# Altium project Cap_Sensor_8x8.PrjPcb
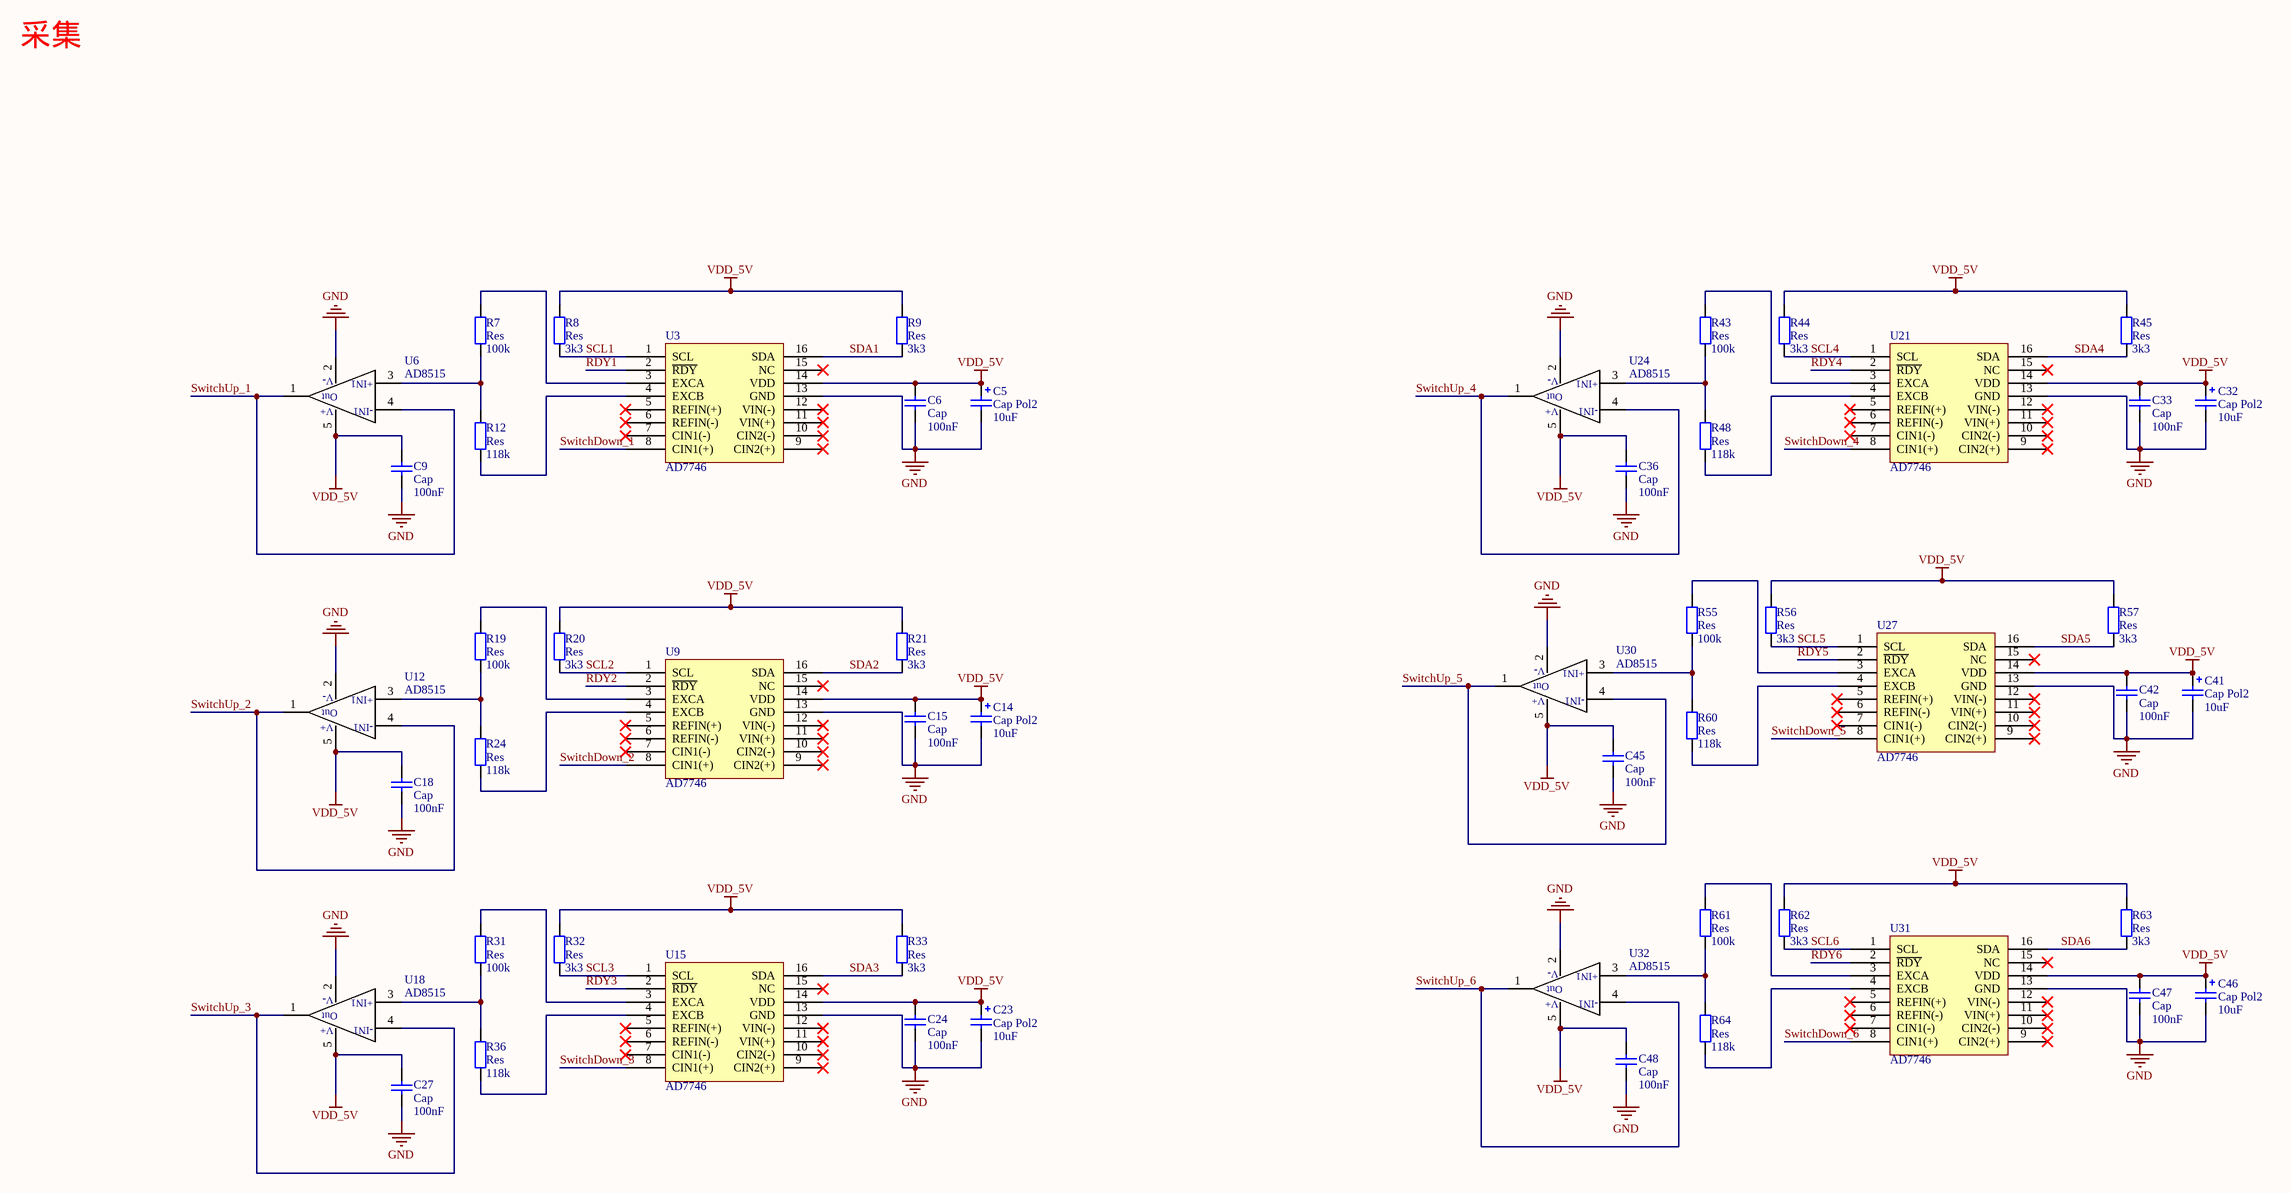
[diagram p0: Cap_Sensor_hand.SchDoc]
2 sheets, 69 parts. Net scope: global (net labels, ports and power ports of the same name join across sheets).
Board file: Cap_Sensor_hand.PcbDoc
Sheets:
  Cap_Sensor_hand.SchDoc
  power_and_interface.SchDoc

## Sheet Cap_Sensor_hand.SchDoc
size A2

### Parts
C5  Cap Pol2  value 10uF  [Cap-TA]
C6  Cap  value 100nF  [0805C]
C9  Cap  value 100nF  [0805C]
C14  Cap Pol2  value 10uF  [Cap-TA]
C15  Cap  value 100nF  [0805C]
C18  Cap  value 100nF  [0805C]
C23  Cap Pol2  value 10uF  [Cap-TA]
C24  Cap  value 100nF  [0805C]
C27  Cap  value 100nF  [0805C]
C32  Cap Pol2  value 10uF  [Cap-TA]
C33  Cap  value 100nF  [0805C]
C36  Cap  value 100nF  [0805C]
C41  Cap Pol2  value 10uF  [Cap-TA]
C42  Cap  value 100nF  [0805C]
C45  Cap  value 100nF  [0805C]
C46  Cap Pol2  value 10uF  [Cap-TA]
C47  Cap  value 100nF  [0805C]
C48  Cap  value 100nF  [0805C]
R7  Res  value 100k  [0805R]
R8  Res  value 3k3  [0805R]
R9  Res  value 3k3  [0805R]
R12  Res  value 118k  [0805R]
R19  Res  value 100k  [0805R]
R20  Res  value 3k3  [0805R]
R21  Res  value 3k3  [0805R]
R24  Res  value 118k  [0805R]
R31  Res  value 100k  [0805R]
R32  Res  value 3k3  [0805R]
R33  Res  value 3k3  [0805R]
R36  Res  value 118k  [0805R]
R43  Res  value 100k  [0805R]
R44  Res  value 3k3  [0805R]
R45  Res  value 3k3  [0805R]
R48  Res  value 118k  [0805R]
R55  Res  value 100k  [0805R]
R56  Res  value 3k3  [0805R]
R57  Res  value 3k3  [0805R]
R60  Res  value 118k  [0805R]
R61  Res  value 100k  [0805R]
R62  Res  value 3k3  [0805R]
R63  Res  value 3k3  [0805R]
R64  Res  value 118k  [0805R]
U3  AD7746  [TSSOP16]
U6  AD8515  [sot23-5]
U9  AD7746  [TSSOP16]
U12  AD8515  [sot23-5]
U15  AD7746  [TSSOP16]
U18  AD8515  [sot23-5]
U21  AD7746  [TSSOP16]
U24  AD8515  [sot23-5]
U27  AD7746  [TSSOP16]
U30  AD8515  [sot23-5]
U31  AD7746  [TSSOP16]
U32  AD8515  [sot23-5]

### Nets
GND: C5.2 C6.1 C9.1 C14.2 C15.1 C18.1 C23.2 C24.1 C27.1 C32.2 C33.1 C36.1 C41.2 C42.1 C45.1 C46.2 C47.1 C48.1 U3.13(GND) U6.2(V-) U9.13(GND) U12.2(V-) U15.13(GND) U18.2(V-) U21.13(GND) U24.2(V-) U27.13(GND) U30.2(V-) U31.13(GND) U32.2(V-)
VDD_5V: C5.1 C6.2 C9.2 C14.1 C15.2 C18.2 C23.1 C24.2 C27.2 C32.1 C33.2 C36.2 C41.1 C42.2 C45.2 C46.1 C47.2 C48.2 R8.2 R9.2 R20.2 R21.2 R32.2 R33.2 R44.2 R45.2 R56.2 R57.2 R62.2 R63.2 U3.14(VDD) U6.5(V+) U9.14(VDD) U12.5(V+) U15.14(VDD) U18.5(V+) U21.14(VDD) U24.5(V+) U27.14(VDD) U30.5(V+) U31.14(VDD) U32.5(V+)
RDY1: U3.2(~{RDY})
RDY2: U9.2(~{RDY})
RDY3: U15.2(~{RDY})
RDY4: U21.2(~{RDY})
RDY5: U27.2(~{RDY})
RDY6: U31.2(~{RDY})
SCL1: R8.1 U3.1(SCL)
SCL2: R20.1 U9.1(SCL)
SCL3: R32.1 U15.1(SCL)
SCL4: R44.1 U21.1(SCL)
SCL5: R56.1 U27.1(SCL)
SCL6: R62.1 U31.1(SCL)
SDA1: R9.1 U3.16(SDA)
SDA2: R21.1 U9.16(SDA)
SDA3: R33.1 U15.16(SDA)
SDA4: R45.1 U21.16(SDA)
SDA5: R57.1 U27.16(SDA)
SDA6: R63.1 U31.16(SDA)
SwitchDown_1: U3.8(CIN1(+))
SwitchDown_2: U9.8(CIN1(+))
SwitchDown_3: U15.8(CIN1(+))
SwitchDown_4: U21.8(CIN1(+))
SwitchDown_5: U27.8(CIN1(+))
SwitchDown_6: U31.8(CIN1(+))
SwitchUp_1: U6.1(Out1) U6.4(-IN)
SwitchUp_2: U12.1(Out1) U12.4(-IN)
SwitchUp_3: U18.1(Out1) U18.4(-IN)
SwitchUp_4: U24.1(Out1) U24.4(-IN)
SwitchUp_5: U30.1(Out1) U30.4(-IN)
SwitchUp_6: U32.1(Out1) U32.4(-IN)
NetR7_1: R7.1 U3.3(EXCA)
NetR7_2: R7.2 R12.1 U6.3(+IN)
NetR12_2: R12.2 U3.4(EXCB)
NetR19_1: R19.1 U9.3(EXCA)
NetR19_2: R19.2 R24.1 U12.3(+IN)
NetR24_2: R24.2 U9.4(EXCB)
NetR31_1: R31.1 U15.3(EXCA)
NetR31_2: R31.2 R36.1 U18.3(+IN)
NetR36_2: R36.2 U15.4(EXCB)
NetR43_1: R43.1 U21.3(EXCA)
NetR43_2: R43.2 R48.1 U24.3(+IN)
NetR48_2: R48.2 U21.4(EXCB)
NetR55_1: R55.1 U27.3(EXCA)
NetR55_2: R55.2 R60.1 U30.3(+IN)
NetR60_2: R60.2 U27.4(EXCB)
NetR61_1: R61.1 U31.3(EXCA)
NetR61_2: R61.2 R64.1 U32.3(+IN)
NetR64_2: R64.2 U31.4(EXCB)

Not connected (* = marked no-connect by the designer): U3 5(REFIN(+))* 6(REFIN(-))* 7(CIN1(-))* 9(CIN2(+))* 10(CIN2(-))* 11(VIN(+))* 12(VIN(-))* 15(NC)*; U9 5(REFIN(+))* 6(REFIN(-))* 7(CIN1(-))* 9(CIN2(+))* 10(CIN2(-))* 11(VIN(+))* 12(VIN(-))* 15(NC)*; U15 5(REFIN(+))* 6(REFIN(-))* 7(CIN1(-))* 9(CIN2(+))* 10(CIN2(-))* 11(VIN(+))* 12(VIN(-))* 15(NC)*; U21 5(REFIN(+))* 6(REFIN(-))* 7(CIN1(-))* 9(CIN2(+))* 10(CIN2(-))* 11(VIN(+))* 12(VIN(-))* 15(NC)*; U27 5(REFIN(+))* 6(REFIN(-))* 7(CIN1(-))* 9(CIN2(+))* 10(CIN2(-))* 11(VIN(+))* 12(VIN(-))* 15(NC)*; U31 5(REFIN(+))* 6(REFIN(-))* 7(CIN1(-))* 9(CIN2(+))* 10(CIN2(-))* 11(VIN(+))* 12(VIN(-))* 15(NC)*

### Notes on the sheet
- Labels drawn without touching a wire or pin: 采集
- Title
- Size:
- Date:
- File:
- A2
- Number:
- Time:
- Revision:
- Sheet
- of
- (in symbol AD8515) +IN1; Out; -IN1

### Library data of the parts
C5 C14 C23 C32 C41 C46 = Cap Pol2: Polarized Capacitor (Axial); Published: 8-Jun-2000; LatestRevisionDate: 17-Jul-2002; LatestRevisionNote: Re-released for DXP Platform.; PackageReference: POLAR0.8; Publisher: Altium Limited; PackageDescription: Polarized Capacitor; 2 Leads
C6 C9 C15 C18 C24 C27 C33 C36 C42 C45 C47 C48 = Cap: Capacitor; Published: 8-Jun-2000; LatestRevisionDate: 17-Jul-2002; LatestRevisionNote: Re-released for DXP Platform.; PackageReference: RAD-0.3; Publisher: Altium Limited; PackageDescription: Radial Cap, Thru-Hole; 2 Leads; 0.3 in Pin Spacing
R7-R9 R12 R19-R21 R24 R31-R33 R36 R43-R45 R48 R55-R57 R60-R64 = Res: Resistor; Published: 8-Jun-2000; LatestRevisionDate: 17-Jul-2002; LatestRevisionNote: Re-released for DXP Platform.; PackageReference: AXIAL-0.4; Publisher: Altium Limited; PackageDescription: Axial Device, Thru-Hole; 2 Leads; 0.4 in Pin Spacing

## Sheet power_and_interface.SchDoc
size A4
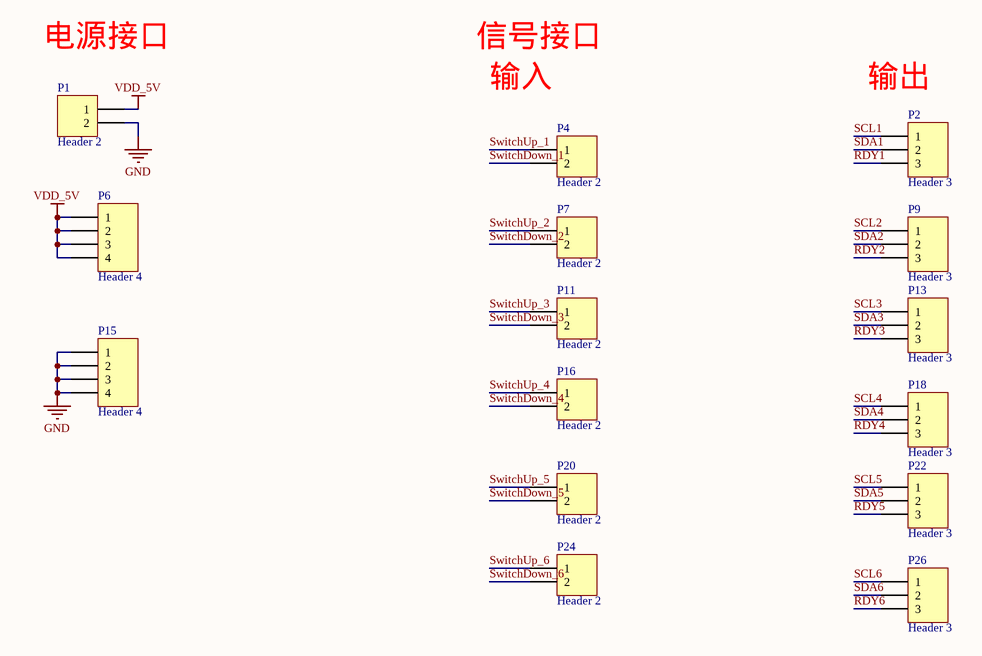
[diagram p1: power_and_interface.SchDoc]

### Parts
P1  Header 2  [XH2.54-LI-2P]
P2  Header 3  [XH2.0_3p]
P4  Header 2  [XH2.0_2p]
P6  Header 4  [HDR1X4]
P7  Header 2  [XH2.0_2p]
P9  Header 3  [XH2.0_3p]
P11  Header 2  [XH2.0_2p]
P13  Header 3  [XH2.0_3p]
P15  Header 4  [HDR1X4]
P16  Header 2  [XH2.0_2p]
P18  Header 3  [XH2.0_3p]
P20  Header 2  [XH2.0_2p]
P22  Header 3  [XH2.0_3p]
P24  Header 2  [XH2.0_2p]
P26  Header 3  [XH2.0_3p]

### Nets
GND: P1.2 P15.1 P15.2 P15.3 P15.4
VDD_5V: P1.1 P6.1 P6.2 P6.3 P6.4
RDY1: P2.3
RDY2: P9.3
RDY3: P13.3
RDY4: P18.3
RDY5: P22.3
RDY6: P26.3
SCL1: P2.1
SCL2: P9.1
SCL3: P13.1
SCL4: P18.1
SCL5: P22.1
SCL6: P26.1
SDA1: P2.2
SDA2: P9.2
SDA3: P13.2
SDA4: P18.2
SDA5: P22.2
SDA6: P26.2
SwitchDown_1: P4.2
SwitchDown_2: P7.2
SwitchDown_3: P11.2
SwitchDown_4: P16.2
SwitchDown_5: P20.2
SwitchDown_6: P24.2
SwitchUp_1: P4.1
SwitchUp_2: P7.1
SwitchUp_3: P11.1
SwitchUp_4: P16.1
SwitchUp_5: P20.1
SwitchUp_6: P24.1

### Notes on the sheet
- Labels drawn without touching a wire or pin: 信号接口, 电源接口, 输入, 输出

### Library data of the parts
P1 P4 P7 P11 P16 P20 P24 = Header 2: Header, 2-Pin; LatestRevisionDate: 17-Jul-2002; LatestRevisionNote: Re-released for DXP Platform.; Publisher: Altium Limited
P2 P9 P13 P18 P22 P26 = Header 3: Header, 3-Pin; LatestRevisionDate: 17-Jul-2002; LatestRevisionNote: Re-released for DXP Platform.; Publisher: Altium Limited
P6 P15 = Header 4: Header, 4-Pin; LatestRevisionDate: 17-Jul-2002; LatestRevisionNote: Re-released for DXP Platform.; Publisher: Altium Limited

## Nets that join several sheets
GND: Cap_Sensor_hand (30 pins), power_and_interface (5 pins)
VDD_5V: Cap_Sensor_hand (42 pins), power_and_interface (5 pins)
RDY1: Cap_Sensor_hand (U3.2), power_and_interface (P2.3)
RDY2: Cap_Sensor_hand (U9.2), power_and_interface (P9.3)
RDY3: Cap_Sensor_hand (U15.2), power_and_interface (P13.3)
RDY4: Cap_Sensor_hand (U21.2), power_and_interface (P18.3)
RDY5: Cap_Sensor_hand (U27.2), power_and_interface (P22.3)
RDY6: Cap_Sensor_hand (U31.2), power_and_interface (P26.3)
SCL1: Cap_Sensor_hand (R8.1 U3.1), power_and_interface (P2.1)
SCL2: Cap_Sensor_hand (R20.1 U9.1), power_and_interface (P9.1)
SCL3: Cap_Sensor_hand (R32.1 U15.1), power_and_interface (P13.1)
SCL4: Cap_Sensor_hand (R44.1 U21.1), power_and_interface (P18.1)
SCL5: Cap_Sensor_hand (R56.1 U27.1), power_and_interface (P22.1)
SCL6: Cap_Sensor_hand (R62.1 U31.1), power_and_interface (P26.1)
SDA1: Cap_Sensor_hand (R9.1 U3.16), power_and_interface (P2.2)
SDA2: Cap_Sensor_hand (R21.1 U9.16), power_and_interface (P9.2)
SDA3: Cap_Sensor_hand (R33.1 U15.16), power_and_interface (P13.2)
SDA4: Cap_Sensor_hand (R45.1 U21.16), power_and_interface (P18.2)
SDA5: Cap_Sensor_hand (R57.1 U27.16), power_and_interface (P22.2)
SDA6: Cap_Sensor_hand (R63.1 U31.16), power_and_interface (P26.2)
SwitchDown_1: Cap_Sensor_hand (U3.8), power_and_interface (P4.2)
SwitchDown_2: Cap_Sensor_hand (U9.8), power_and_interface (P7.2)
SwitchDown_3: Cap_Sensor_hand (U15.8), power_and_interface (P11.2)
SwitchDown_4: Cap_Sensor_hand (U21.8), power_and_interface (P16.2)
SwitchDown_5: Cap_Sensor_hand (U27.8), power_and_interface (P20.2)
SwitchDown_6: Cap_Sensor_hand (U31.8), power_and_interface (P24.2)
SwitchUp_1: Cap_Sensor_hand (U6.1 U6.4), power_and_interface (P4.1)
SwitchUp_2: Cap_Sensor_hand (U12.1 U12.4), power_and_interface (P7.1)
SwitchUp_3: Cap_Sensor_hand (U18.1 U18.4), power_and_interface (P11.1)
SwitchUp_4: Cap_Sensor_hand (U24.1 U24.4), power_and_interface (P16.1)
SwitchUp_5: Cap_Sensor_hand (U30.1 U30.4), power_and_interface (P20.1)
SwitchUp_6: Cap_Sensor_hand (U32.1 U32.4), power_and_interface (P24.1)